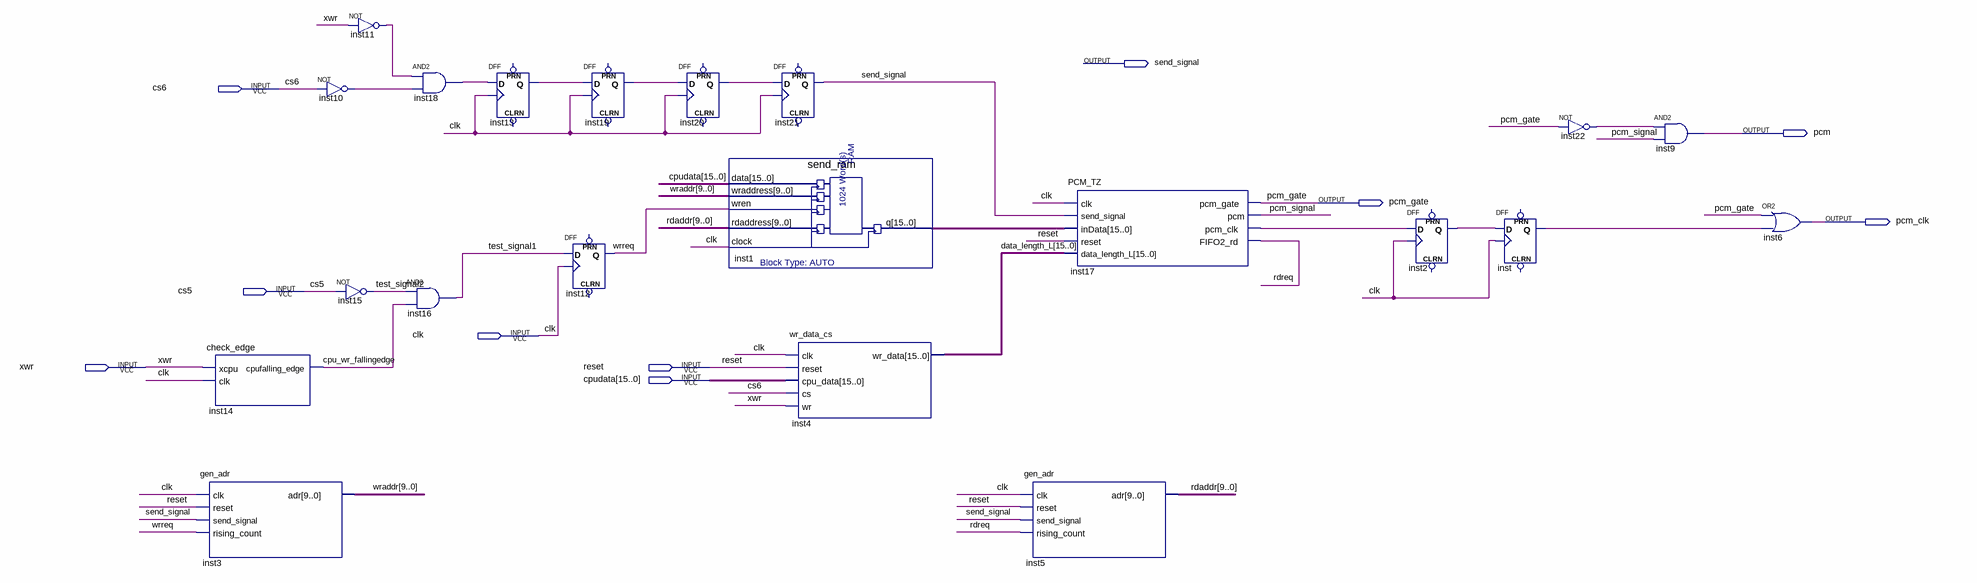
[diagram p0: schematic sheet]
// Quartus schematic DataImmit.bdf as structural Verilog: 21 symbols, 10 pins
module DataImmit (
  input  cs6,
  input  cs5,
  input  clk,
  input  xwr,
  input  reset,
  input  [15:0] cpudata,
  output send_signal,
  output pcm,
  output pcm_gate,
  output pcm_clk
);

  wire cpu_wr_fallingedge, inst2_q, inst10_out, inst11_out, inst13_q, inst17_pcm_clk, inst18_out, inst19_q,
       inst20_q, inst22_out, inst_q, pcm_signal, rdreq, test_signal1, test_signal2, wrreq;
  wire [9:0] rdaddr, wraddr;
  wire [15:0] data_length_L, inst1_q;

  check_edge inst14 (.xcpu(xwr), .clk(clk), .cpufalling_edge(cpu_wr_fallingedge));
  gen_adr inst3 (.clk(clk), .reset(reset), .send_signal(send_signal), .rising_count(wrreq), .adr(wraddr));
  not inst10 (inst10_out, cs6);
  not inst11 (inst11_out, xwr);
  not inst15 (test_signal2, cs5);
  and inst18 (inst18_out, inst11_out, inst10_out);
  and inst16 (test_signal1, test_signal2, cpu_wr_fallingedge);
  DFF inst13 (.CLK(clk), .D(inst18_out), .Q(inst13_q));  // open: CLRN, PRN
  DFF inst19 (.CLK(clk), .D(inst13_q), .Q(inst19_q));  // open: CLRN, PRN
  DFF inst12 (.CLK(clk), .D(test_signal1), .Q(wrreq));  // open: CLRN, PRN
  DFF inst20 (.CLK(clk), .D(inst19_q), .Q(inst20_q));  // open: CLRN, PRN
  send_ram inst1 (.data(cpudata), .wraddress(wraddr), .wren(wrreq), .rdaddress(rdaddr), .clock(clk), .q(inst1_q));
  DFF inst21 (.CLK(clk), .D(inst20_q), .Q(send_signal));  // open: CLRN, PRN
  wr_data_cs inst4 (.clk(clk), .reset(reset), .cpu_data(cpudata), .cs(cs6), .wr(xwr), .wr_data(data_length_L));
  gen_adr inst5 (.clk(clk), .reset(reset), .send_signal(send_signal), .rising_count(rdreq), .adr(rdaddr));
  PCM_TZ inst17 (
    .clk(clk), .send_signal(send_signal), .inData(inst1_q), .reset(reset), .data_length_L(data_length_L),
    .pcm_gate(pcm_gate), .pcm(pcm_signal), .pcm_clk(inst17_pcm_clk), .FIFO2_rd(rdreq));
  DFF inst2 (.CLK(clk), .D(inst17_pcm_clk), .Q(inst2_q));  // open: CLRN, PRN
  DFF inst (.CLK(clk), .D(inst2_q), .Q(inst_q));  // open: CLRN, PRN
  not inst22 (inst22_out, pcm_gate);
  and inst9 (pcm, inst22_out, pcm_signal);
  or inst6 (pcm_clk, pcm_gate, inst_q);
endmodule
